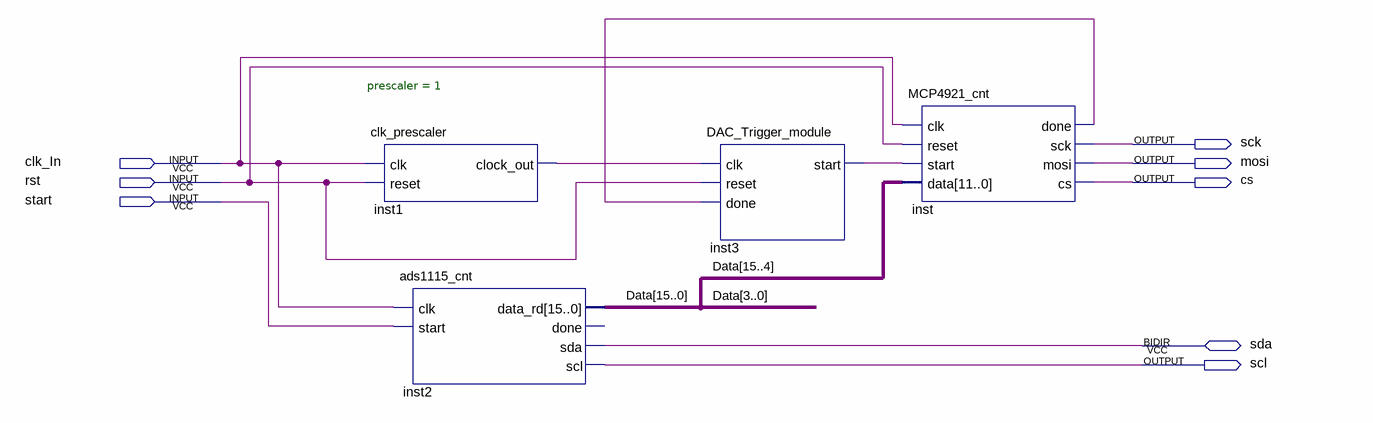
[diagram p0: schematic sheet]
// Quartus schematic ADC_DAC_BlockConnection.bdf as structural Verilog: 4 symbols, 8 pins
module ADC_DAC_BlockConnection (
  input  clk_In,
  input  rst,
  input  start,
  inout  sda,
  output sck,
  output mosi,
  output cs,
  output scl
);

  wire inst1_clock_out, inst3_start, inst_done;
  wire [15:0] Data;

  clk_prescaler #(.prescaler(1)) inst1 (.clk(clk_In), .reset(rst), .clock_out(inst1_clock_out));
  ads1115_cnt inst2 (.clk(clk_In), .start(start), .data_rd(Data), .scl(scl), .sda(sda));  // open: done
  DAC_Trigger_module inst3 (.clk(inst1_clock_out), .reset(rst), .done(inst_done), .start(inst3_start));
  MCP4921_cnt inst (
    .clk(clk_In), .reset(rst), .start(inst3_start), .data(Data[15:4]), .done(inst_done), .sck(sck),
    .mosi(mosi), .cs(cs));
endmodule
